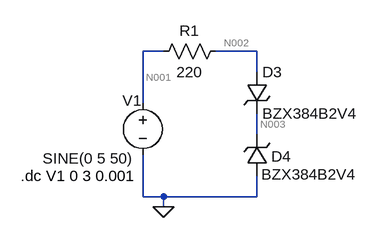
[diagram p0: schematic exercise2_transient_1.asc]
exercise2_transient_1.asc, the LTspice schematic file:
Version 4
SHEET 1 880 680
WIRE 160 48 128 48
WIRE 304 48 240 48
WIRE 304 80 304 48
WIRE 128 128 128 48
WIRE 304 176 304 144
WIRE 128 272 128 208
WIRE 160 272 128 272
WIRE 304 272 304 240
WIRE 304 272 160 272
WIRE 160 288 160 272
FLAG 160 288 0
SYMBOL res 256 32 R90
WINDOW 0 0 56 VBottom 2
WINDOW 3 32 56 VTop 2
SYMATTR InstName R1
SYMATTR Value 220
SYMBOL zener 288 80 R0
SYMATTR InstName D3
SYMATTR Value BZX384B2V4
SYMBOL zener 320 240 R180
WINDOW 0 -37 30 Left 2
WINDOW 3 -136 2 Left 2
SYMATTR InstName D4
SYMATTR Value BZX384B2V4
SYMBOL voltage 128 112 R0
WINDOW 0 -31 12 Left 2
WINDOW 3 -154 101 Left 2
WINDOW 123 0 0 Left 0
WINDOW 39 0 0 Left 0
SYMATTR InstName V1
SYMATTR Value SINE(0 5 50)
TEXT -60 240 Left 2 !.dc V1 0 3 0.001

The netlist it stands for:
* exercise2_transient_1.asc
R1 N002 N001 220
D3 N002 N003 BZX384B2V4
D4 0 N003 BZX384B2V4
V1 N001 0 SINE(0 5 50)
.model D D
.lib standard.dio
.dc V1 0 3 0.001
.backanno
.end

* Results of the author's LTspice run, read from the files saved beside the schematic
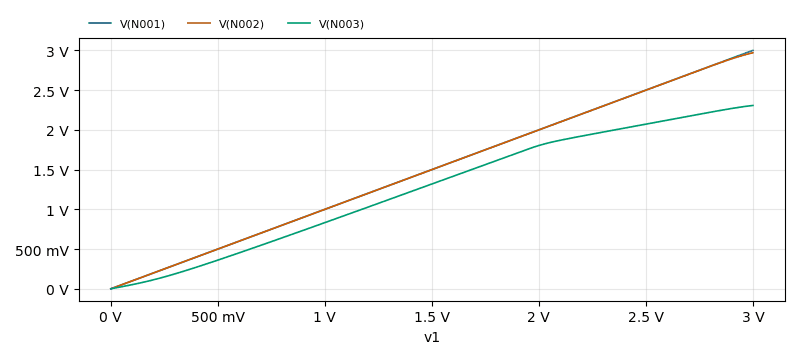
[diagram p1: DC transfer characteristic of exercise2_transient_1.asc, plotted from the saved traces]
* DC transfer characteristic, 1 run:
*   V(N001): 0 V at v1=0 V, 3 V at v1=3 V, min 0 V, max 3 V
*   V(N002): 0 V at v1=0 V, 2.97 V at v1=3 V, min 0 V, max 2.97 V
*   V(N003): 0 V at v1=0 V, 2.307 V at v1=3 V, min 0 V, max 2.307 V